# Altium schematic sheet blue.SchDoc
size A4
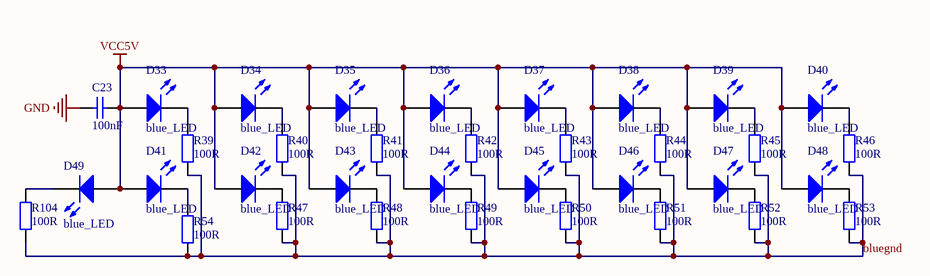
[diagram p0: blue.SchDoc]

## Parts
C23  100nF  [CC2012-0805]
D33  blue_LED  [LED5MM]
D34  blue_LED  [LED5MM]
D35  blue_LED  [LED5MM]
D36  blue_LED  [LED5MM]
D37  blue_LED  [LED5MM]
D38  blue_LED  [LED5MM]
D39  blue_LED  [LED5MM]
D40  blue_LED  [LED5MM]
D41  blue_LED  [LED5MM]
D42  blue_LED  [LED5MM]
D43  blue_LED  [LED5MM]
D44  blue_LED  [LED5MM]
D45  blue_LED  [LED5MM]
D46  blue_LED  [LED5MM]
D47  blue_LED  [LED5MM]
D48  blue_LED  [LED5MM]
D49  blue_LED  [LED5MM]
R39  100R  [CR2012-0805]
R40  100R  [CR2012-0805]
R41  100R  [CR2012-0805]
R42  100R  [CR2012-0805]
R43  100R  [CR2012-0805]
R44  100R  [CR2012-0805]
R45  100R  [CR2012-0805]
R46  100R  [CR2012-0805]
R47  100R  [CR2012-0805]
R48  100R  [CR2012-0805]
R49  100R  [CR2012-0805]
R50  100R  [CR2012-0805]
R51  100R  [CR2012-0805]
R52  100R  [CR2012-0805]
R53  100R  [CR2012-0805]
R54  100R  [CR2012-0805]
R104  100R  [CR2012-0805]

## Nets
GND: C23.2
VCC5V: C23.1 D33.1(A) D34.1(A) D35.1(A) D36.1(A) D37.1(A) D38.1(A) D39.1(A) D40.1(A) D41.1(A) D42.1(A) D43.1(A) D44.1(A) D45.1(A) D46.1(A) D47.1(A) D48.1(A) D49.1(A)
bluegnd: R39.1 R40.1 R41.1 R42.1 R43.1 R44.1 R45.1 R46.1 R47.1 R48.1 R49.1 R50.1 R51.1 R52.1 R53.1 R54.1 R104.1
NetD33_2: D33.2(K) R39.2
NetD34_2: D34.2(K) R40.2
NetD35_2: D35.2(K) R41.2
NetD36_2: D36.2(K) R42.2
NetD37_2: D37.2(K) R43.2
NetD38_2: D38.2(K) R44.2
NetD39_2: D39.2(K) R45.2
NetD40_2: D40.2(K) R46.2
NetD41_2: D41.2(K) R54.2
NetD42_2: D42.2(K) R47.2
NetD43_2: D43.2(K) R48.2
NetD44_2: D44.2(K) R49.2
NetD45_2: D45.2(K) R50.2
NetD46_2: D46.2(K) R51.2
NetD47_2: D47.2(K) R52.2
NetD48_2: D48.2(K) R53.2
NetD49_2: D49.2(K) R104.2

## Library data of the parts
C23 = Cap Semi: Capacitor (Semiconductor SIM Model); Published: 8-Jun-2000; LatestRevisionDate: 17-Jul-2002; LatestRevisionNote: Re-released for DXP Platform.; PackageReference: C1206; Publisher: Altium Limited
D33-D49 = LED: Typical RED GaAs LED; Published: 8-Jun-2000; LatestRevisionDate: 08-Jul-2005; LatestRevisionNote: Mech Layer 1 removed.; PackageReference: LED-1; Publisher: Altium Limited
R39-R54 R104 = Res2: Resistor; Published: 8-Jun-2000; Revision: July-2002: Re-released for DXP Platform.; Publisher: Altium Limited; Value: 100R